# Altium schematic sheet CarryLookahead.SchDoc
size A4
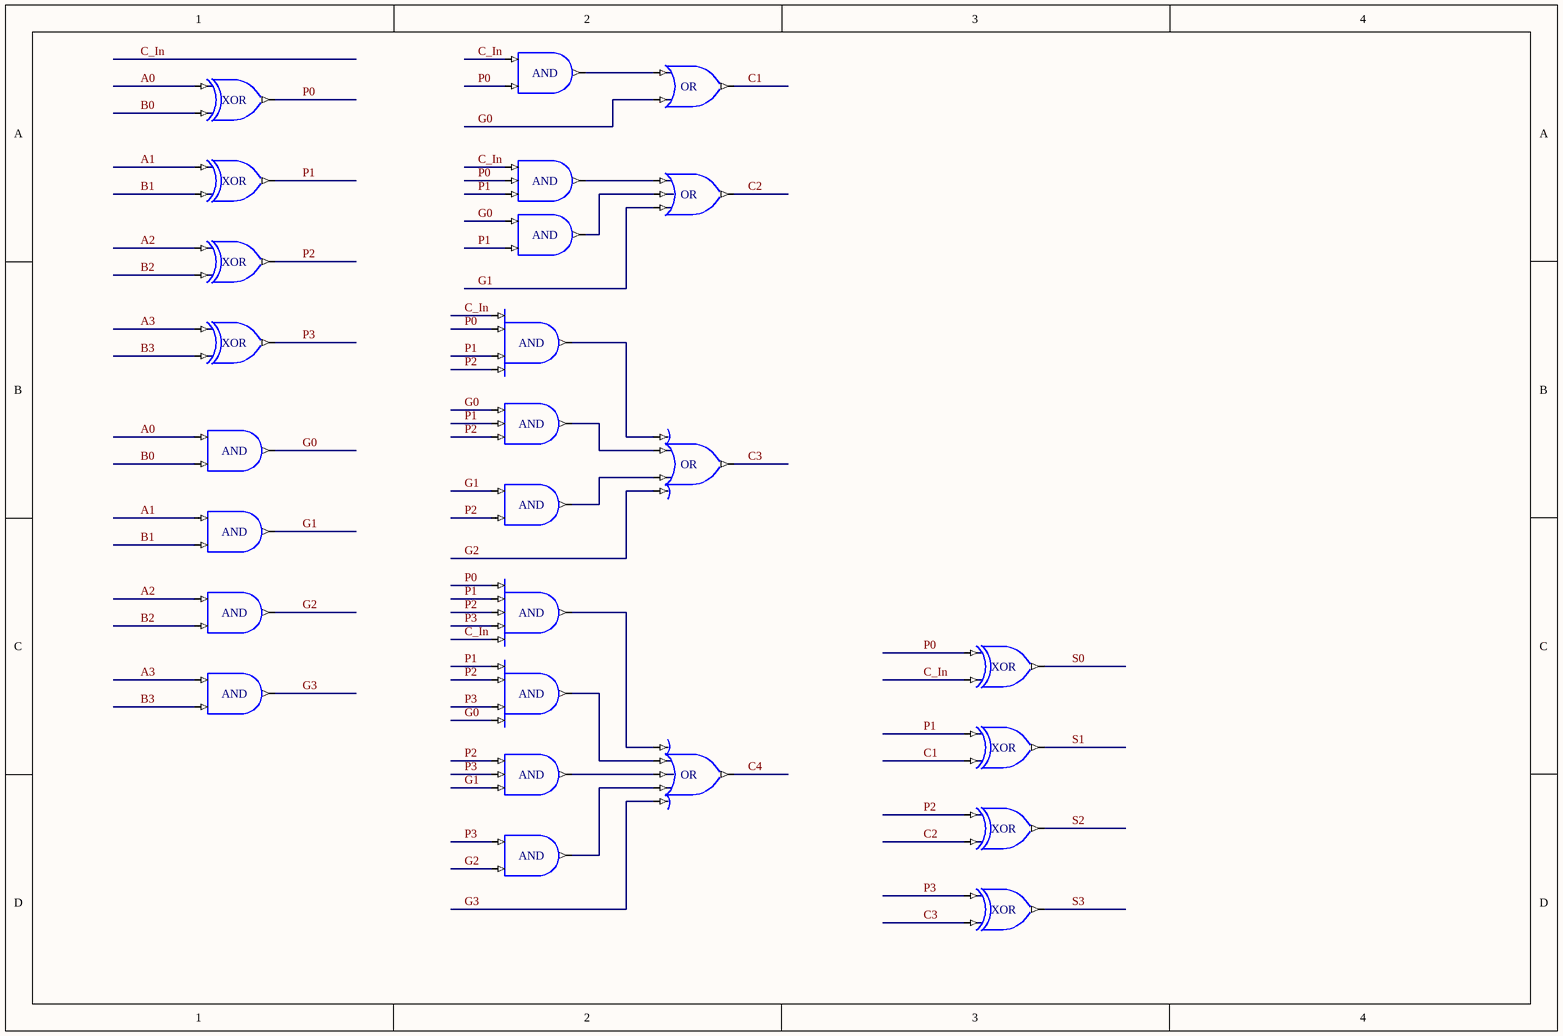
[diagram p0: CarryLookahead.SchDoc]

## Parts
(Parts that share a designator on the sheet are numbered #1, #2 ... from top to bottom, then left to right.)
U?#1  AND
U?#2  OR
U?#3  XOR
U?#4  XOR
U?#5  AND
U?#6  OR
U?#7  AND
U?#8  XOR
U?#9  XOR
U?#10  AND
U?#11  AND
U?#12  AND
U?#13  OR
U?#14  AND
U?#15  AND
U?#16  AND
U?#17  AND
U?#18  XOR
U?#19  AND
U?#20  AND
U?#21  XOR
U?#22  AND
U?#23  OR
U?#24  XOR
U?#25  AND
U?#26  XOR

## Nets
A0: U?#3.I0 U?#12.I0
A1: U?#4.I0 U?#15.I0
A2: U?#8.I0 U?#16.I0
A3: U?#9.I0 U?#19.I0
B0: U?#3.I1 U?#12.I1
B1: U?#4.I1 U?#15.I1
B2: U?#8.I1 U?#16.I1
B3: U?#9.I1 U?#19.I1
C1: U?#2.O U?#21.I1
C2: U?#6.O U?#24.I1
C3: U?#13.O U?#26.I1
C4: U?#23.O
C_In: U?#1.I0 U?#5.I0 U?#10.I0 U?#17.I4 U?#18.I1
G0: U?#2.I1 U?#7.I0 U?#11.I0 U?#12.O U?#20.I3
G1: U?#6.I2 U?#14.I0 U?#15.O U?#22.I2
G2: U?#13.I3 U?#16.O U?#25.I1
G3: U?#19.O U?#23.I4
P0: U?#1.I1 U?#3.O U?#5.I1 U?#10.I1 U?#17.I0 U?#18.I0
P1: U?#4.O U?#5.I2 U?#7.I1 U?#10.I2 U?#11.I1 U?#17.I1 U?#20.I0 U?#21.I0
P2: U?#8.O U?#10.I3 U?#11.I2 U?#14.I1 U?#17.I2 U?#20.I1 U?#22.I0 U?#24.I0
P3: U?#9.O U?#17.I3 U?#20.I2 U?#22.I1 U?#25.I0 U?#26.I0
S0: U?#18.O
S1: U?#21.O
S2: U?#24.O
S3: U?#26.O
NetU?#1_O: U?#1.O U?#2.I0
NetU?#5_O: U?#5.O U?#6.I0
NetU?#6_I1: U?#6.I1 U?#7.O
NetU?#10_O: U?#10.O U?#13.I0
NetU?#11_O: U?#11.O U?#13.I1
NetU?#13_I2: U?#13.I2 U?#14.O
NetU?#17_O: U?#17.O U?#23.I0
NetU?#20_O: U?#20.O U?#23.I1
NetU?#22_O: U?#22.O U?#23.I2
NetU?#23_I3: U?#23.I3 U?#25.O

## Library data of the parts
U?#1 U?#7 U?#12 U?#14-U?#16 U?#19 U?#25 = AND2S: 2-Input AND Gate, Single Pin Version; XilinxEquivalent: AND2; FunctionalClass: Logic Primitive; PortSize: 2; ArchiveName: GENERIC; VHDLIB_SIM: GENERIC_LIB; Published: 29-Jan-2004; Publisher: Altium Limited; LastRevisionNo: 1.00.00; HelpURL: CR0118 FPGA Generic Library Guide.pdf#page=114; ComponentLink1URL: CR0136 FPGA Logic Primitive Resource Usage.pdf#page=13; ComponentLink1Description: Core &Resource Usage; SubClass: AND; PortStyle: Single Pin Version
U?#2 = OR2S: 2-Input OR Gate, Single Pin Version; XilinxEquivalent: OR2; FunctionalClass: Logic Primitive; PortSize: 2; ArchiveName: GENERIC; VHDLIB_SIM: GENERIC_LIB; Published: 29-Jan-2004; Publisher: Altium Limited; LastRevisionNo: 1.00.00; HelpURL: CR0118 FPGA Generic Library Guide.pdf#page=410; ComponentLink1URL: CR0136 FPGA Logic Primitive Resource Usage.pdf#page=190; ComponentLink1Description: Core &Resource Usage; SubClass: OR; PortStyle: Single Pin Version
U?#3 U?#4 U?#8 U?#9 U?#18 U?#21 U?#24 U?#26 = XOR2S: 2-Input Exclusive-OR Gate, Single Pin Version; XilinxEquivalent: XOR2; FunctionalClass: Logic Primitive; PortSize: 2; ArchiveName: GENERIC; VHDLIB_SIM: GENERIC_LIB; Published: 29-Jan-2004; Publisher: Altium Limited; LastRevisionNo: 1.00.00; HelpURL: CR0118 FPGA Generic Library Guide.pdf#page=448; ComponentLink1URL: CR0136 FPGA Logic Primitive Resource Usage.pdf#page=301; ComponentLink1Description: Core &Resource Usage; SubClass: XOR; PortStyle: Single Pin Version
U?#5 U?#11 U?#22 = AND3S: 3-Input AND Gate, Single Pin Version; XilinxEquivalent: AND3; FunctionalClass: Logic Primitive; PortSize: 3; ArchiveName: GENERIC; VHDLIB_SIM: GENERIC_LIB; Published: 29-Jan-2004; Publisher: Altium Limited; LastRevisionNo: 1.00.00; HelpURL: CR0118 FPGA Generic Library Guide.pdf#page=114; ComponentLink1URL: CR0136 FPGA Logic Primitive Resource Usage.pdf#page=23; ComponentLink1Description: Core &Resource Usage; SubClass: AND; PortStyle: Single Pin Version
U?#6 = OR3S: 3-Input OR Gate, Single Pin Version; XilinxEquivalent: OR3; FunctionalClass: Logic Primitive; PortSize: 3; ArchiveName: GENERIC; VHDLIB_SIM: GENERIC_LIB; Published: 29-Jan-2004; Publisher: Altium Limited; LastRevisionNo: 1.00.00; HelpURL: CR0118 FPGA Generic Library Guide.pdf#page=410; ComponentLink1URL: CR0136 FPGA Logic Primitive Resource Usage.pdf#page=200; ComponentLink1Description: Core &Resource Usage; SubClass: OR; PortStyle: Single Pin Version
U?#10 U?#20 = AND4S: 4-Input AND Gate, Single Pin Version; XilinxEquivalent: AND4; FunctionalClass: Logic Primitive; PortSize: 4; ArchiveName: GENERIC; VHDLIB_SIM: GENERIC_LIB; Published: 29-Jan-2004; Publisher: Altium Limited; LastRevisionNo: 1.00.00; HelpURL: CR0118 FPGA Generic Library Guide.pdf#page=114; ComponentLink1URL: CR0136 FPGA Logic Primitive Resource Usage.pdf#page=35; ComponentLink1Description: Core &Resource Usage; SubClass: AND; PortStyle: Single Pin Version
U?#13 = OR4S: 4-Input OR Gate, Single Pin Version; XilinxEquivalent: OR4; FunctionalClass: Logic Primitive; PortSize: 4; ArchiveName: GENERIC; VHDLIB_SIM: GENERIC_LIB; Published: 29-Jan-2004; Publisher: Altium Limited; LastRevisionNo: 1.00.00; HelpURL: CR0118 FPGA Generic Library Guide.pdf#page=410; ComponentLink1URL: CR0136 FPGA Logic Primitive Resource Usage.pdf#page=212; ComponentLink1Description: Core &Resource Usage; SubClass: OR; PortStyle: Single Pin Version
U?#17 = AND5S: 5-Input AND Gate, Single Pin Version; XilinxEquivalent: AND5; FunctionalClass: Logic Primitive; PortSize: 5; ArchiveName: GENERIC; VHDLIB_SIM: GENERIC_LIB; Published: 29-Jan-2004; Publisher: Altium Limited; LastRevisionNo: 1.00.00; HelpURL: CR0118 FPGA Generic Library Guide.pdf#page=114; ComponentLink1URL: CR0136 FPGA Logic Primitive Resource Usage.pdf#page=47; ComponentLink1Description: Core &Resource Usage; SubClass: AND; PortStyle: Single Pin Version
U?#23 = OR5S: 5-Input OR Gate, Single Pin Version; XilinxEquivalent: OR5; FunctionalClass: Logic Primitive; PortSize: 5; ArchiveName: GENERIC; VHDLIB_SIM: GENERIC_LIB; Published: 29-Jan-2004; Publisher: Altium Limited; LastRevisionNo: 1.00.00; HelpURL: CR0118 FPGA Generic Library Guide.pdf#page=410; ComponentLink1URL: CR0136 FPGA Logic Primitive Resource Usage.pdf#page=224; ComponentLink1Description: Core &Resource Usage; SubClass: OR; PortStyle: Single Pin Version